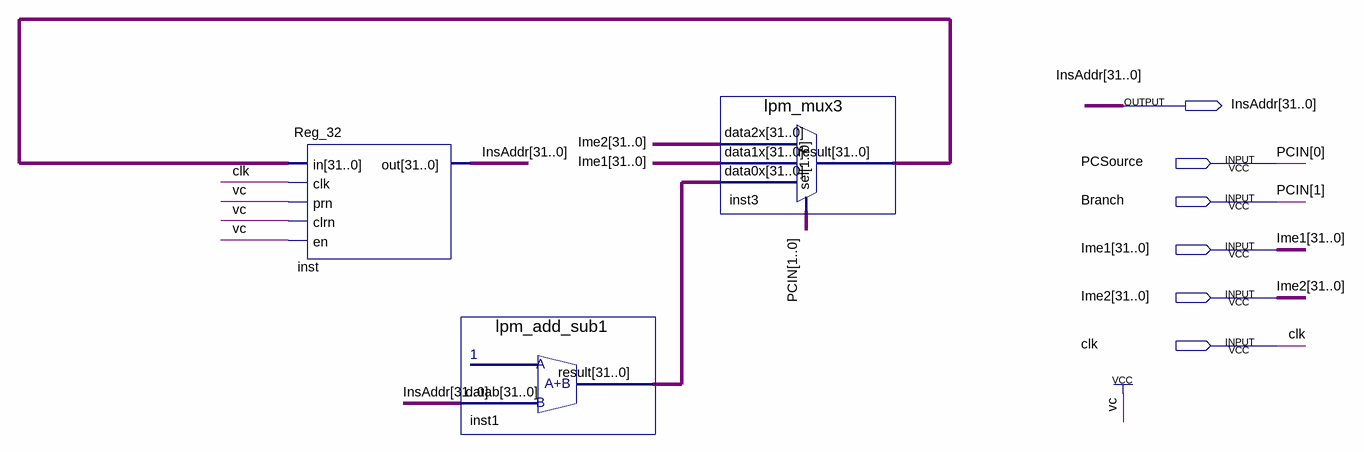
[diagram p0: schematic sheet]
// Quartus schematic PC.bdf as structural Verilog: 3 symbols, 6 pins
module PC (
  input  PCSource,
  input  Branch,
  input  [31:0] Ime1,
  input  [31:0] Ime2,
  input  clk,
  output [31:0] InsAddr
);

  wire [31:0] inst1_result, inst3_result;

  Reg_32 inst (.in(inst3_result), .clk(clk), .prn(1'b1), .clrn(1'b1), .en(1'b1), .out(InsAddr));
  lpm_add_sub1 inst1 (.datab(InsAddr), .result(inst1_result));
  lpm_mux3 inst3 (.data2x(Ime2), .data1x(Ime1), .data0x(inst1_result), .sel({Branch, PCSource}), .result(inst3_result));

  // Other names for the same wires on the sheet: PCIN[1:0] = {Branch, PCSource}
endmodule
